# EasyEDA schematic DA2_FIN.json
TITLE: FT232RL; REV: 1.0; Date: 2023-06-28; Sheet: 1/1; Company: Your Company
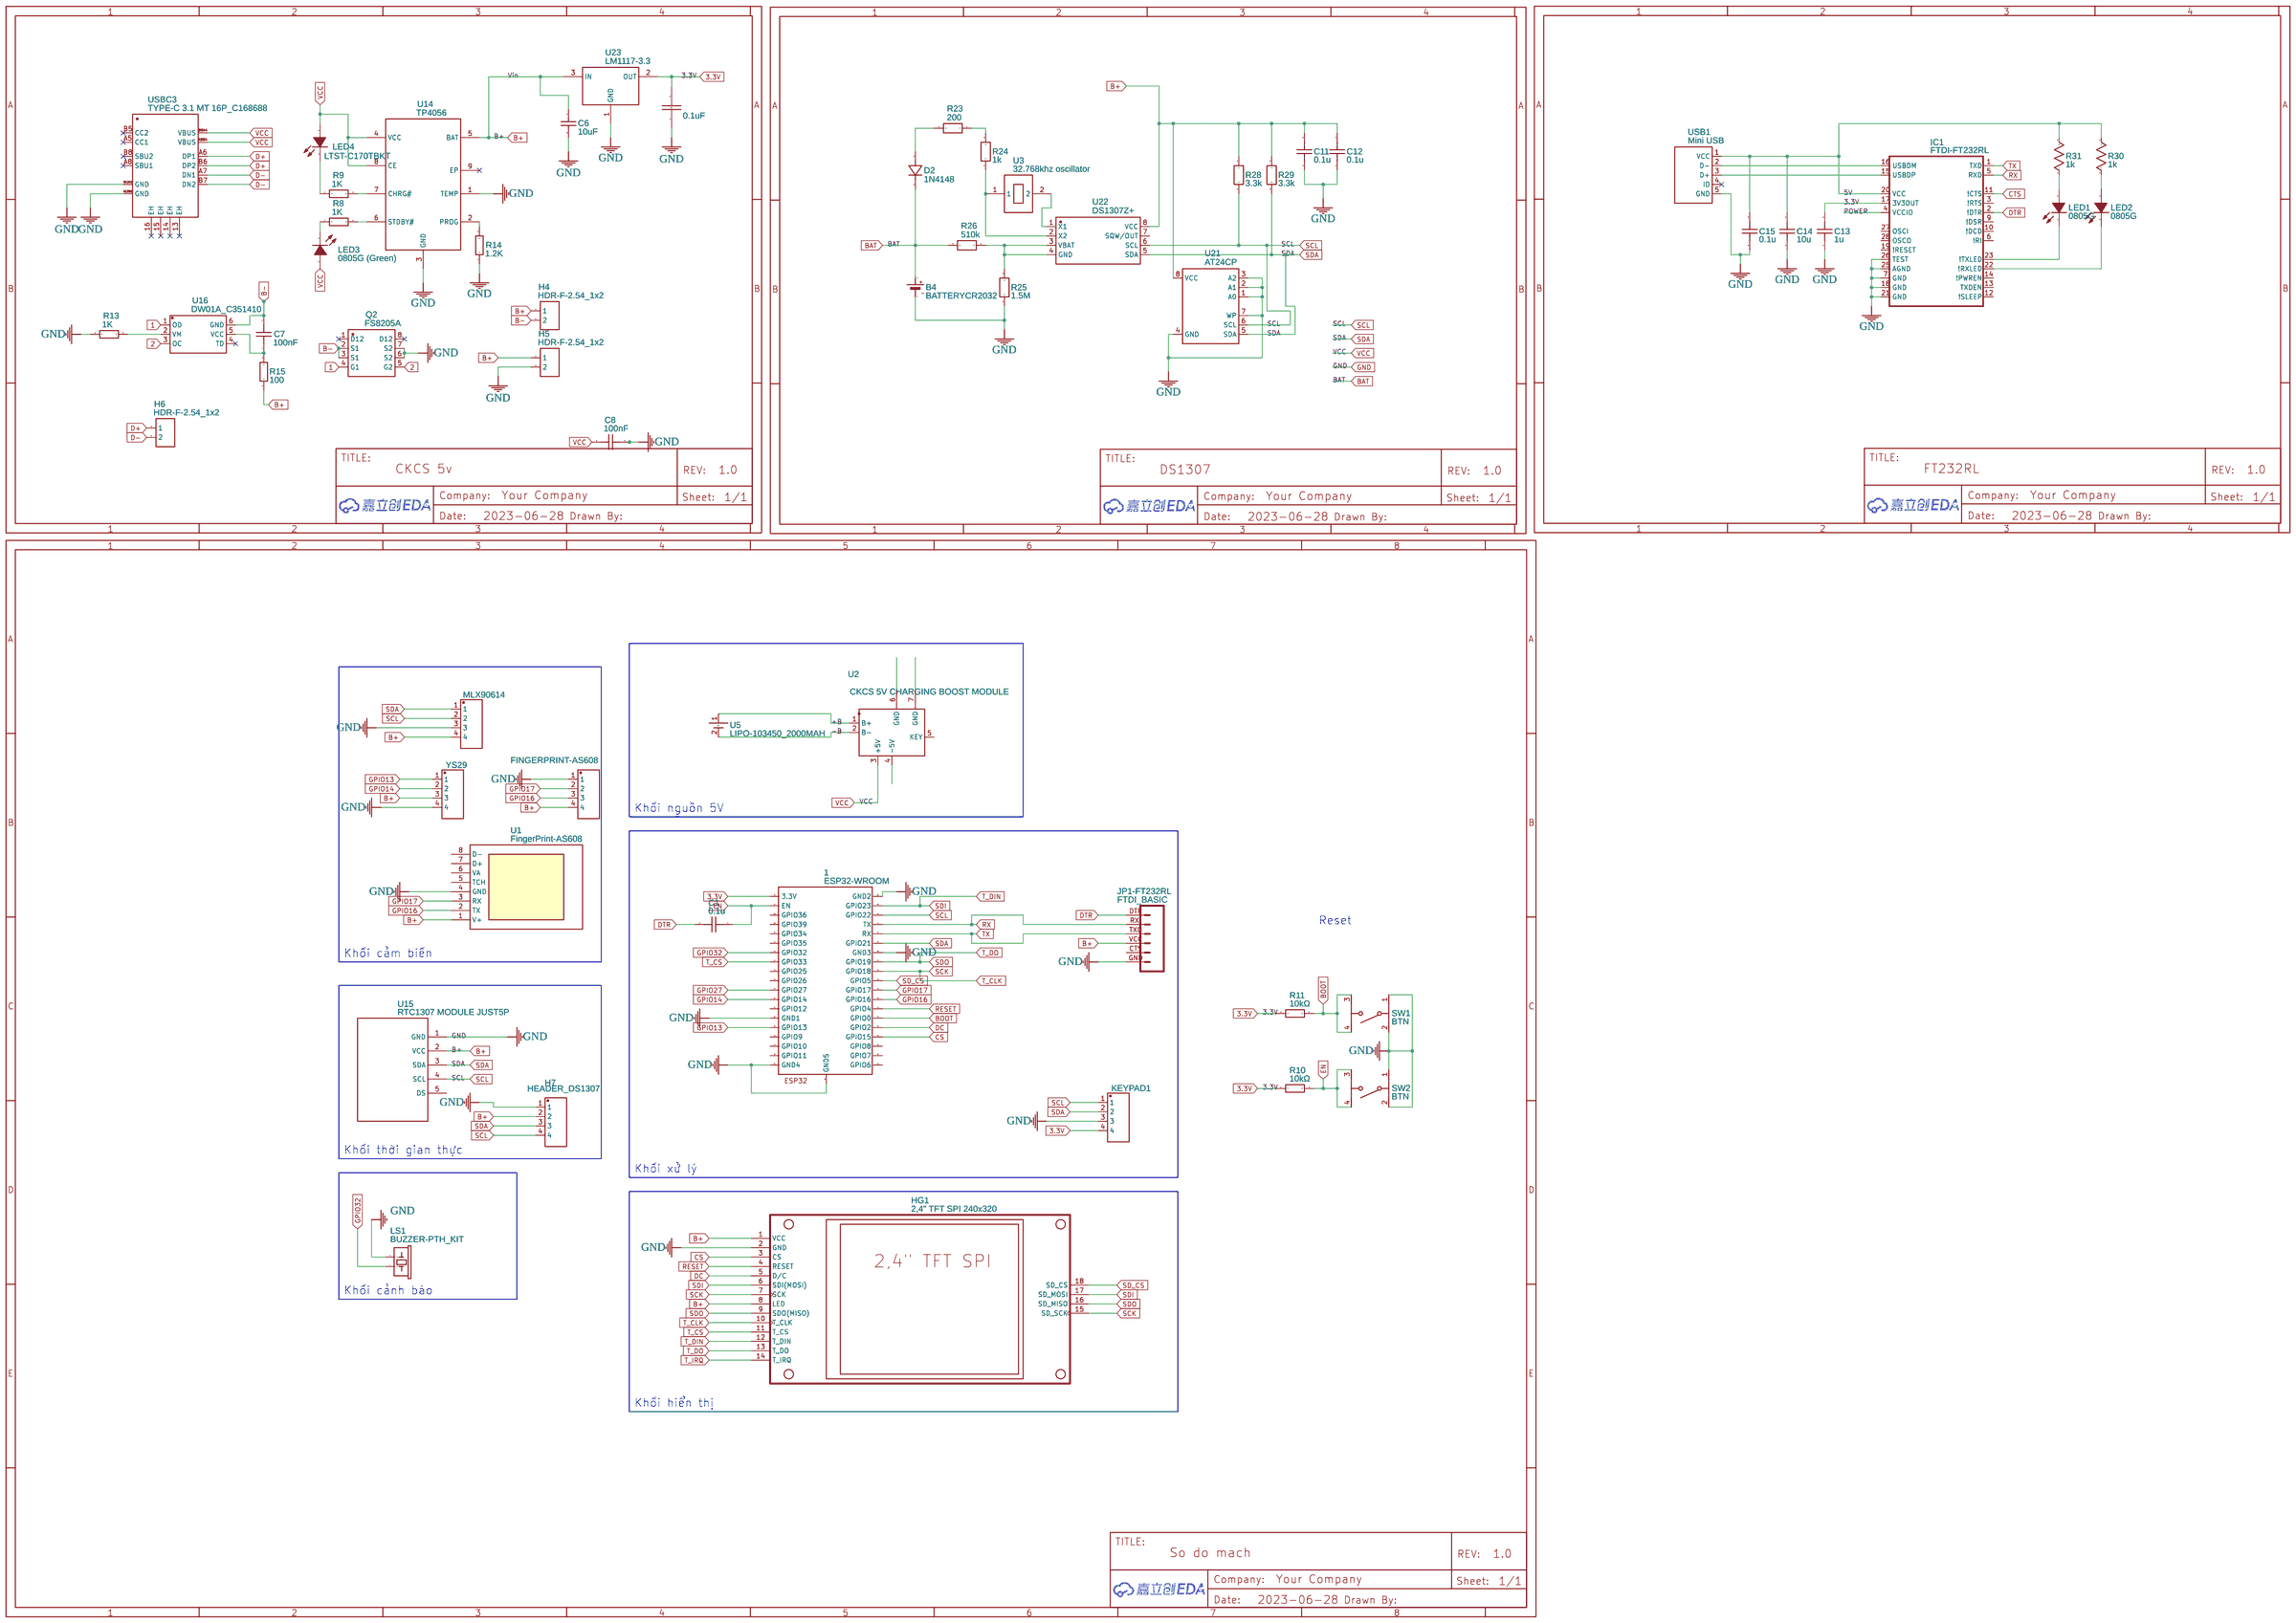
[diagram p0: schematic sheet]

## Parts
1  ESP32-WROOM  [ESP32-WROOM]
2  0.1uF  [C0805]
B4  BATTERYCR2032  [CR2032_4U_15728]
C1  0.1u  [C0805]
C6  10uF  [C0805]
C7  100nF  [C0805]
C8  100nF  [C0805]
C11  0.1u  [C0805]
C12  0.1u  [C0805]
C13  1u  [C0805]
C14  10u  [C0805]
C15  0.1u  [C0805]
D2  1N4148  [SOD-323_L1.6-W1.3-LS2.7-RD]
FINGERPRINT-AS608  HEADER 1X4P COPY COPY  [HEADER - HEADER-FEMALE-2.54_1X4]
H4  HDR-F-2.54_1x2  [HDR-F-2.54_1X2]
H5  HDR-F-2.54_1x2  [HDR-F-2.54_1X2]
H6  HDR-F-2.54_1x2  [HDR-F-2.54_1X2]
H7  HEADER_DS1307  [HEADER - HEADER-FEMALE-2.54_1X4]
HG1  2,4" TFT SPI 240x320  [2.4_TFT_TS]
IC1  FTDI-FT232RL  [SSOP28]
JP1-FT232RL  FTDI_BASIC  [FTDI_BASIC]
KEYPAD1  HEADER 1X4P COPY COPY  [HEADER - HEADER-FEMALE-2.54_1X4]
LED1  0805G  [LED0805-RD_GREEN]
LED2  0805G  [LED0805-RD_GREEN]
LED3  0805G (Green)  [LED0805-RD_GREEN]
LED4  LTST-C170TBKT  [LED0805-RD_BLUE]
LS1  BUZZER-PTH_KIT  [BUZZER-12MM-KIT]
MLX90614  HEADER 1X4P COPY COPY  [HEADER - HEADER-FEMALE-2.54_1X4]
Q2  FS8205A  [TSSOP-8_L4.4-W3.0-P0.65-LS6.4-BL-2]
R8  1K  [R0805]
R9  1K  [R0805]
R10  10kΩ  [R0805]
R11  10kΩ  [R0805]
R13  1K  [R0805]
R14  1.2K  [R0805]
R15  100  [R0805]
R23  200  [R0805]
R24  1k  [R0805]
R25  1.5M  [R0805]
R26  510k  [R0805]
R28  3.3k  [R0805]
R29  3.3k  [R0805]
R30  1k  [R0805]
R31  1k  [R0805]
SW1  BTN  [SW-TH_4P-L6.0-W6.0-P4.50-LS6.1]
SW2  BTN  [SW-TH_4P-L6.0-W6.0-P4.50-LS6.1]
U1  FingerPrint-AS608  [SIL-6]
U2  CKCS 5V CHARGING BOOST MODULE  [CKCS 5V CHARGING MODULE]
U3  32.768khz oscillator  [32.768KHZ OSCILLATOR]
U5  LIPO-103450_2000MAH  [LIPO-103450_2000MAH]
U14  TP4056  [ESOP-8_L4.9-W3.9-P1.27-LS6.0-BL-EP]
U15  RTC1307 MODULE JUST5P  [RTC1307 MODULE]
U16  DW01A_C351410  [SOT-23-6_L2.9-W1.6-P0.95-LS2.8-BL]
U21  AT24CP  [DIL08]
U22  DS1307Z+  [SOIC-8_L5.0-W4.0-P1.27-LS6.0-BL]
U23  LM1117-3.3  [LM1117-3.3 UP]
USB1  Mini USB  [MINI-USB-SMD_MINI-5PTP]
USBC3  TYPE-C 3.1 MT 16P_C168688  [USB-C-SMD_TYPE-C-USB-4]
YS29  HEADER 1X4P COPY COPY  [HEADER - HEADER-FEMALE-2.54_1X4]

## Library data of the parts
1 = ESP32-WROOM: Contributor: eagleone
2 = cap 0.1uF 50V 0805: Manufacturer: AILLEN; Supplier: Digi-Key; Contributor: angelemus005
B4 = BATTERYCR2032: Contributor: farmerjoe0606
C1 C13-C15 = Cap_1206_US: Manufacturer Part: ?
C6 = CC0805KKX5R6BB106: Supplier: LCSC; Manufacturer: YAGEO; Supplier Part: C89832; JLCPCB Part Class: Extended Part
C7 C8 = C0805B104M500NT: Supplier: LCSC; Supplier Part: C515949; Manufacturer: 火炬; Contributor: LCSC; JLCPCB Part Class: Extended Part
C11 C12 = C_0603_US: Contributor: LCEDA_Lib
D2 = 1N4148WSG_C2904852: Supplier: LCSC; Supplier Part: C2904852; Manufacturer: SHIKUES(时科); Manufacturer Part: 1N4148WSG; JLCPCB Part Class: Extended Part; Contributor: lcsc
FINGERPRINT-AS608 H7 KEYPAD1 MLX90614 YS29 = HEADER 1X4P COPY COPY: Contributor: trananhkha2406; Supplier: Sparkfun
H4-H6 = HDR-F-2.54_1x2: Supplier Part: C49661; Supplier: LCSC; Contributor: LCEDA_Lib
HG1 = 2,4&amp;quot; TFT SPI 240x320: Manufacturer Part: 2,4" TFT SPI; Contributor: IgnatiusF
IC1 = -: Contributor: mrsunny; Manufacturer Part: ?
JP1-FT232RL = -: Contributor: SparkFun; Manufacturer Part: ?
LED1-LED3 = 0805G (Green): Supplier: LCSC; Manufacturer: KENTO; Supplier Part: C2297; JLCPCB Part Class: Basic Part
LED4 = LTST-C170TBKT: Supplier: LCSC; Manufacturer: LITEON; Contributor: LCSC; Supplier Part: C98222
LS1 = BUZZER-PTH_KIT: Contributor: tech download
Q2 = FS8205A: Supplier: LCSC; Manufacturer: FORTUNE; Supplier Part: C16052; JLCPCB Part Class: Basic Part
R8 R9 R13 = AECR0603F1K00K9: Supplier: LCSC; Supplier Part: C328340; Manufacturer: ResistorToday; Contributor: LCSC; JLCPCB Part Class: Extended Part
R10 R11 = PTFR1206B10K0P9: Supplier: LCSC; Supplier Part: C351536; Manufacturer: ResistorToday; Contributor: LCSC; Resistance (Ohms): 10K; JLCPCB Part Class: Extended Part
R14 = RMC06031.2K5%N: Supplier: LCSC; Supplier Part: C269681; Manufacturer: Tyohm; Contributor: LCSC; JLCPCB Part Class: Extended Part
R15 = AECR0603F100RK9: Supplier: LCSC; Supplier Part: C328334; Manufacturer: ResistorToday; Contributor: LCSC; JLCPCB Part Class: Extended Part
R23-R26 R28 R29 = R_0603_EU: Contributor: LCEDA_Lib
R30 R31 = Res_1206(1/4W)_US: Manufacturer Part: ?
SW1 SW2 = Button-6x6x6mm: Supplier Part: C71836; Supplier: LCSC; Manufacturer: BBJ; Manufacturer Part: Switch,6*6*6Plastic head,260G, 0.25mm,Straight line
U1 = FingerPrint-AS608: Manufacturer Part: AS-608; Contributor: lvvperera
U2 = CKCS 5V CHARGING BOOST MODULE: Supplier: DYKBmetered; link: https://www.aliexpress.com/item/1005001428397158.html?spm=a2g0s.9042311.0.0.17b44c4d9Ls686; Contributor: odorica
U3 = 32.768khz oscillator: Contributor: pattykarigi96
U5 = LIPO-103450_2000MAH: link: https://www.myarduino.net/product/2675/%E0%B9%81%E0%B8%9A%E0%B8%95%E0%B9%80%E0%B8%95%E0%B8%AD%E0%B8%A3%E0%B8%B5%E0%B9%88-%E0%B8%A5%E0%B8%B5%E0%B9%80%E0%B8%98%E0%B8%B5%E0%B9%88%E0%B8%A2%E0%B8%A1%E0%B9%82%E0%B8%9E%E0%B8%A5%E0%B8%B4%E0%B9%80%E0%B8%A1%E0%B8%AD%E0%B8%A3%E0%B9%8C-3-7v-%E0%B8%84%E0%B8%A7%E0%B8%B2%E0%B8%A1%E0%B8%88%E0%B8%B8-2000mah-103450-lithium-polymer-battery; Contributor: MEBenz
U14 = TP4056: Contributor: Guest; Supplier: LCSC; Manufacturer: TOPPOWER; Supplier Part: C16581; JLCPCB Part Class: Basic Part
U15 = RTC1307 MODULE JUST5P: link: https://www.openhacks.com/uploadsproductos/tiny_rtc_-_elecrow.pdf; Contributor: Abdul Muis
U16 = DW01A_C351410: Supplier: LCSC; Supplier Part: C351410; Manufacturer: PUOLOP; Manufacturer Part: DW01A; Contributor: LCSC; JLCPCB Part Class: Extended Part
U21 = AT24CP: 2-wire serial EEPROM
U22 = DS1307Z+: Supplier: LCSC; Supplier Part: C1520446; Manufacturer: MAXIM(美信); Contributor: LCSC; JLCPCB Part Class: Extended Part
U23 = LM1117-3.3: Contributor: dimitr_dm
USB1 = Mini USB: Contributor: Филипп Восоль
USBC3 = TYPE-C 3.1 MT 16P_C168688: Supplier: LCSC; Supplier Part: C168688; Manufacturer: LCSC; Contributor: Аксултан Кадыр; JLCPCB Part Class: Extended Part

## Nets
3.3V: 1.3V3(3.3V) 2.2 C13.2 IC1.17(3V3OUT) KEYPAD1.4 R10.1 R11.1 U23.2(OUT)
5V: C14.2 C15.2 IC1.20(VCC) R30.2 R31.2 USB1.1(VCC)
GND: 1.GND1 1.GND2 1.GND3 1.GND4 1.GND5 2.1 B4.- C6.2 C8.2 C11.1 C12.1 C13.1 C14.1 C15.1 FINGERPRINT-AS608.1 H5.2 H7.1 HG1.2(GND) IC1.7(GND) IC1.18(GND) IC1.21(GND) IC1.25(AGND) IC1.26(TEST) JP1-FT232RL.GND(6) KEYPAD1.3 LS1.+(1) MLX90614.3 Q2.6(S2) Q2.7(S2) R13.1 R14.1 R25.1 SW1.1 SW1.2 SW2.1 SW2.2 U1.4(GND) U14.1(TEMP) U14.3(GND) U15.1(GND) U21.1(A0) U21.2(A1) U21.3(A2) U21.4(GND) U21.7(WP) U23.1(GND) USB1.5(GND) USBC3.A12B1(GND) USBC3.B12A1(GND) YS29.4
VCC: C8.1 LED3.2(A) LED4.2(A) U2.3(+5V) U14.4(VCC) U14.8(CE) USBC3.A9B4(VBUS) USBC3.B9A4(VBUS)
1: Q2.4(G1) U16.1(OD)
2: Q2.5(G2) U16.3(OC)
+B: U2.1(B+) U5.1(POS)
-B: U2.2(B-) U5.2(POS)
B+: C6.1 C11.2 C12.2 FINGERPRINT-AS608.4 H4.1 H5.1 H7.2 HG1.1(VCC) HG1.8(LED) JP1-FT232RL.VCC(4) MLX90614.4 R15.1 R28.2 R29.2 U1.1(V+) U14.5(BAT) U15.2(VCC) U21.8(VCC) U22.8(VCC) U23.3(IN) YS29.3
B-: C7.2 H4.2 Q2.2(S1) Q2.3(S1) U16.6(GND)
BAT: B4.+ D2.1(K) R26.1
BOOT: 1.IO0(GPIO0) R11.2 SW1.3 SW1.4
CS: 1.IO15(GPIO15) HG1.3(CS)
CTS: IC1.11(!CTS)
D+: H6.1 USBC3.A6(DP1) USBC3.B6(DP2)
D-: H6.2 USBC3.A7(DN1) USBC3.B7(DN2)
DC: 1.IO2(GPIO2) HG1.5(D/C)
DTR: C1.2 IC1.2(!DTR) JP1-FT232RL.DTR(1)
EN: 1.EN C1.1 R10.2 SW2.3 SW2.4
GPIO13: 1.IO13(GPIO13) YS29.1
GPIO14: 1.IO14(GPIO14) YS29.2
GPIO16: 1.IO16(GPIO16) FINGERPRINT-AS608.3 U1.2(TX)
GPIO17: 1.IO17(GPIO17) FINGERPRINT-AS608.2 U1.3(RX)
GPIO27: 1.IO27(GPIO27)
GPIO32: 1.IO32(GPIO32) LS1.-(2)
POWER: IC1.4(VCCIO)
RESET: 1.IO4(GPIO4) HG1.4(RESET)
RX: 1.TX IC1.5(RXD) JP1-FT232RL.RXI(2)
SCK: 1.IO18(GPIO18) HG1.7(SCK) HG1.10(T_CLK) HG1.15(SD_SCK)
SCL: 1.IO22(GPIO22) H7.4 KEYPAD1.1 MLX90614.2 R28.1 U15.4(SCL) U21.6(SCL) U22.6(SCL)
SD_CS: 1.IO5(GPIO5) HG1.18(SD_CS)
SDA: 1.IO21(GPIO21) H7.3 KEYPAD1.2 MLX90614.1 R29.1 U15.3(SDA) U21.5(SDA) U22.5(SDA)
SDI: 1.IO23(GPIO23) HG1.6(SDI(MOSI)) HG1.12(T_DIN) HG1.17(SD_MOSI)
SDO: 1.IO19(GPIO19) HG1.9(SDO(MISO)) HG1.13(T_DO) HG1.16(SD_MISO)
T_CS: 1.IO33(GPIO33) HG1.11(T_CS)
T_IRQ: HG1.14(T_IRQ)
TX: 1.RX IC1.1(TXD) JP1-FT232RL.TXO(3)
Net-(C7-1): C7.1 R15.2 U16.5(VCC)
Net-(D2-2): D2.2(A) R23.2
Net-(IC1-15): IC1.15(USBDP) USB1.3(D+)
Net-(IC1-16): IC1.16(USBDM) USB1.2(D-)
Net-(IC1-22): IC1.22(!RXLED) LED2.1(K)
Net-(IC1-23): IC1.23(!TXLED) LED1.1(K)
Net-(LED1-2): LED1.2(A) R31.1
Net-(LED2-2): LED2.2(A) R30.1
Net-(LED3-1): LED3.1(K) R8.1
Net-(LED4-1): LED4.1(K) R9.1
Net-(R8-2): R8.2 U14.6(STDBY#)
Net-(R9-2): R9.2 U14.7(CHRG#)
Net-(R13-2): R13.2 U16.2(VM)
Net-(R14-2): R14.2 U14.2(PROG)
Net-(R23-1): R23.1 R24.2
Net-(R24-1): R24.1 U3.1 U22.2(X2)
Net-(R25-2): R25.2 R26.2 U22.3(VBAT) U22.4(GND)
Net-(U3-2): U3.2 U22.1(X1)

Not connected (* = marked no-connect by the designer): 1 CLK(GPIO6) CMD(GPIO11) IO12(GPIO12) IO25(GPIO25) IO26(GPIO26) IO34(GPIO34) IO35(GPIO35) SD0(GPIO7) SD1(GPIO8) SD2(GPIO9) SD3(GPIO10) SENSOR_VN(GPIO39) SENSOR_VP(GPIO36); IC1 3(!RTS) 6(!RI) 9(!DSR) 10(!DCD) 12(!SLEEP) 13(TXDEN) 14(!PWREN) 19(!RESET) 27(OSCI) 28(OSCO); JP1-FT232RL CTS(5); Q2 1(D12)* 8(D12)*; U1 5(TCH) 6(VA) 7(D+) 8(D-); U2 4(-5V) 5(KEY) 6(GND) 7(GND); U14 9(EP)*; U15 5(DS); U16 4(TD)*; U22 7(SQW/OUT); USB1 4(ID)*; USBC3 13(EH)* 14(EH)* 15(EH)* 16(EH)* A5(CC1)* A8(SBU1)* B5(CC2)* B8(SBU2)*

## Notes on the sheet
- Khối nguồn 5V
- Reset
- Khối cảm biến
- Khối thời gian thực
- Khối xử lý
- Khối cảnh báo
- Khối hiển thị
